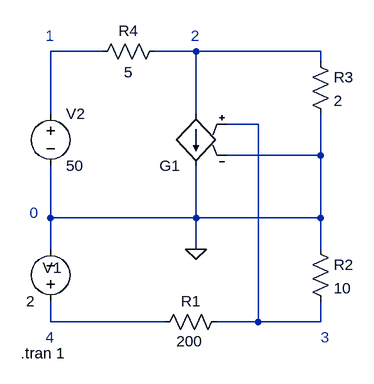
[diagram p0: schematic edthw1.asc]
edthw1.asc, the LTspice schematic file:
Version 4
SHEET 1 880 680
WIRE -176 -64 -256 -64
WIRE -32 -64 -96 -64
WIRE 160 -64 -32 -64
WIRE 160 -48 160 -64
WIRE -256 32 -256 -64
WIRE -32 32 -32 -64
WIRE 64 48 16 48
WIRE 160 96 160 32
WIRE 160 96 16 96
WIRE -256 192 -256 112
WIRE -32 192 -32 112
WIRE -32 192 -256 192
WIRE 160 192 160 96
WIRE 160 192 -32 192
WIRE -256 240 -256 192
WIRE -32 240 -32 192
WIRE 160 240 160 192
WIRE -256 352 -256 320
WIRE -80 352 -256 352
WIRE 64 352 64 48
WIRE 64 352 0 352
WIRE 160 352 160 320
WIRE 160 352 64 352
FLAG -32 240 0
SYMBOL res -80 -80 R90
WINDOW 0 0 56 VBottom 2
WINDOW 3 32 56 VTop 2
SYMATTR InstName R4
SYMATTR Value 5
SYMBOL res 144 -64 R0
SYMATTR InstName R3
SYMATTR Value 2
SYMBOL res 144 224 R0
SYMATTR InstName R2
SYMATTR Value 10
SYMBOL res 16 336 R90
WINDOW 0 0 56 VBottom 2
WINDOW 3 30 58 VTop 2
SYMATTR InstName R1
SYMATTR Value 200
SYMBOL voltage -256 16 R0
WINDOW 123 0 0 Left 2
WINDOW 39 0 0 Left 2
SYMATTR InstName V2
SYMATTR Value 50
SYMBOL voltage -256 336 R180
WINDOW 0 12 67 Right 2
WINDOW 3 24 16 Left 2
WINDOW 123 0 0 Left 2
WINDOW 39 0 0 Left 2
SYMATTR InstName V1
SYMATTR Value 2
SYMBOL g2 -32 128 R180
WINDOW 3 24 -12 Left 2
SYMATTR Value ""
SYMATTR InstName G1
SYMATTR SpiceModel 10
TEXT -264 -88 Left 2 ;1
TEXT -40 -88 Left 2 ;2
TEXT -288 184 Left 2 ;0
TEXT 160 376 Left 2 ;3
TEXT -264 376 Left 2 ;4
TEXT -302 400 Left 2 !.tran 1

The netlist it stands for:
* edthw1.asc
R4 N002 N001 5
R3 N002 0 2
R2 0 N003 10
R1 N003 N004 200
V2 N001 0 50
V1 N004 0 2
G1 N002 0 N003 0 10
* 1
* 2
* 0
* 3
* 4
.tran 1
.backanno
.end